# EAGLE board M885E (EAGLE 6.6.0), part 1 of 2
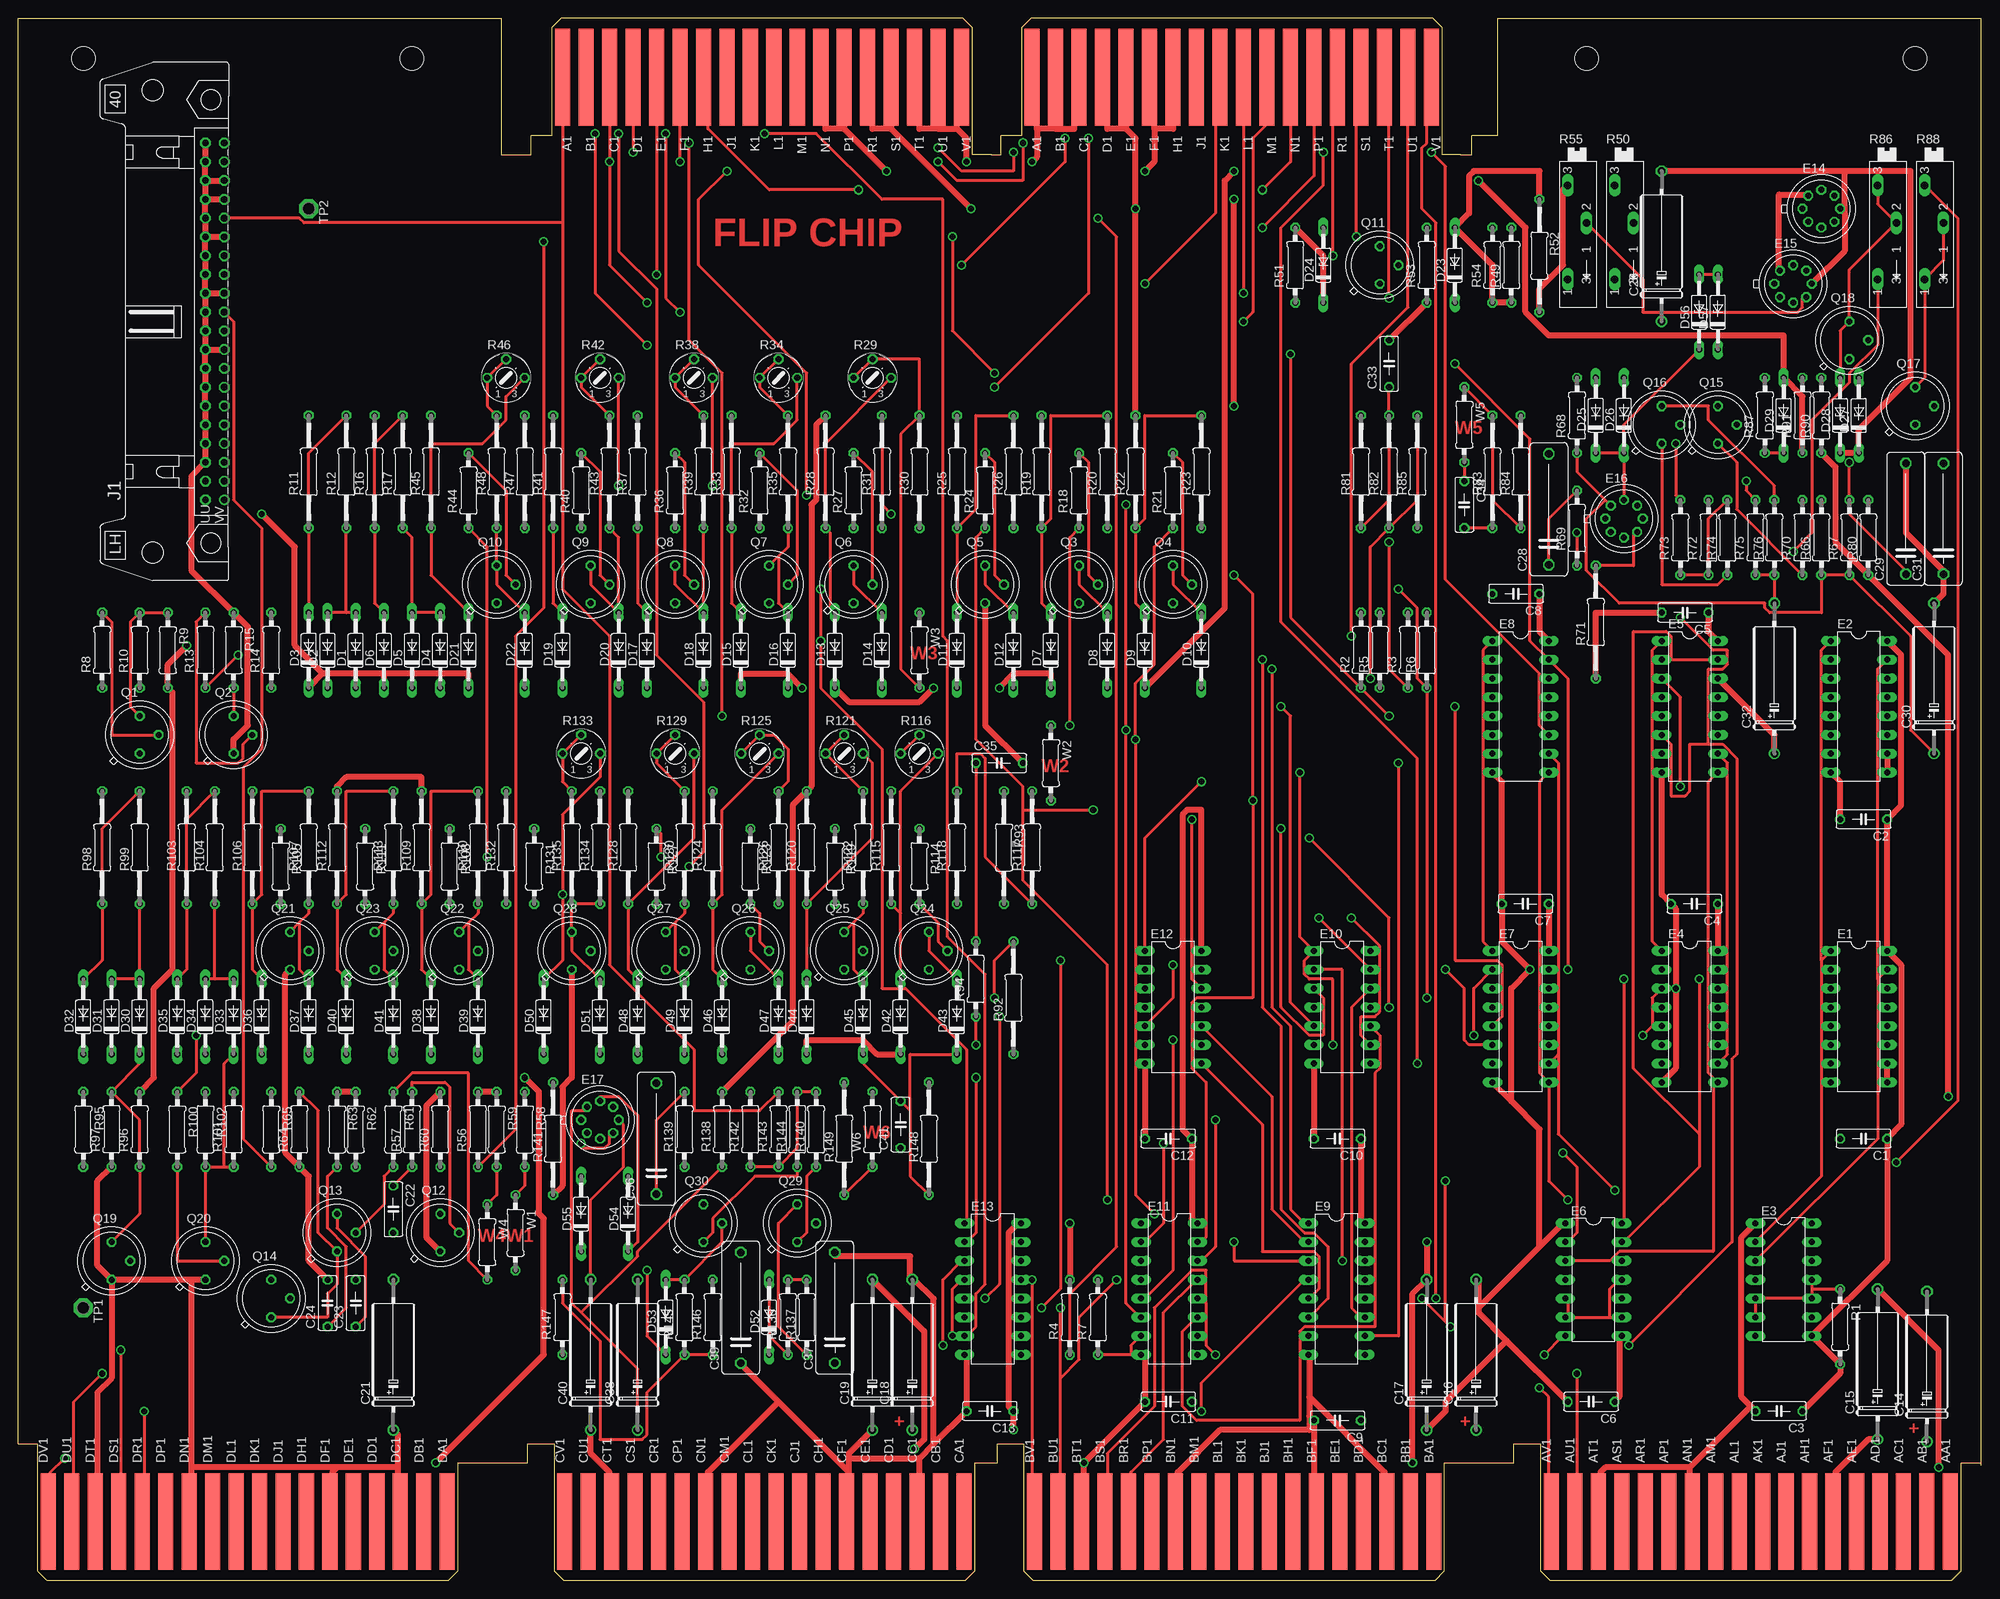
[diagram p2: board, top side]
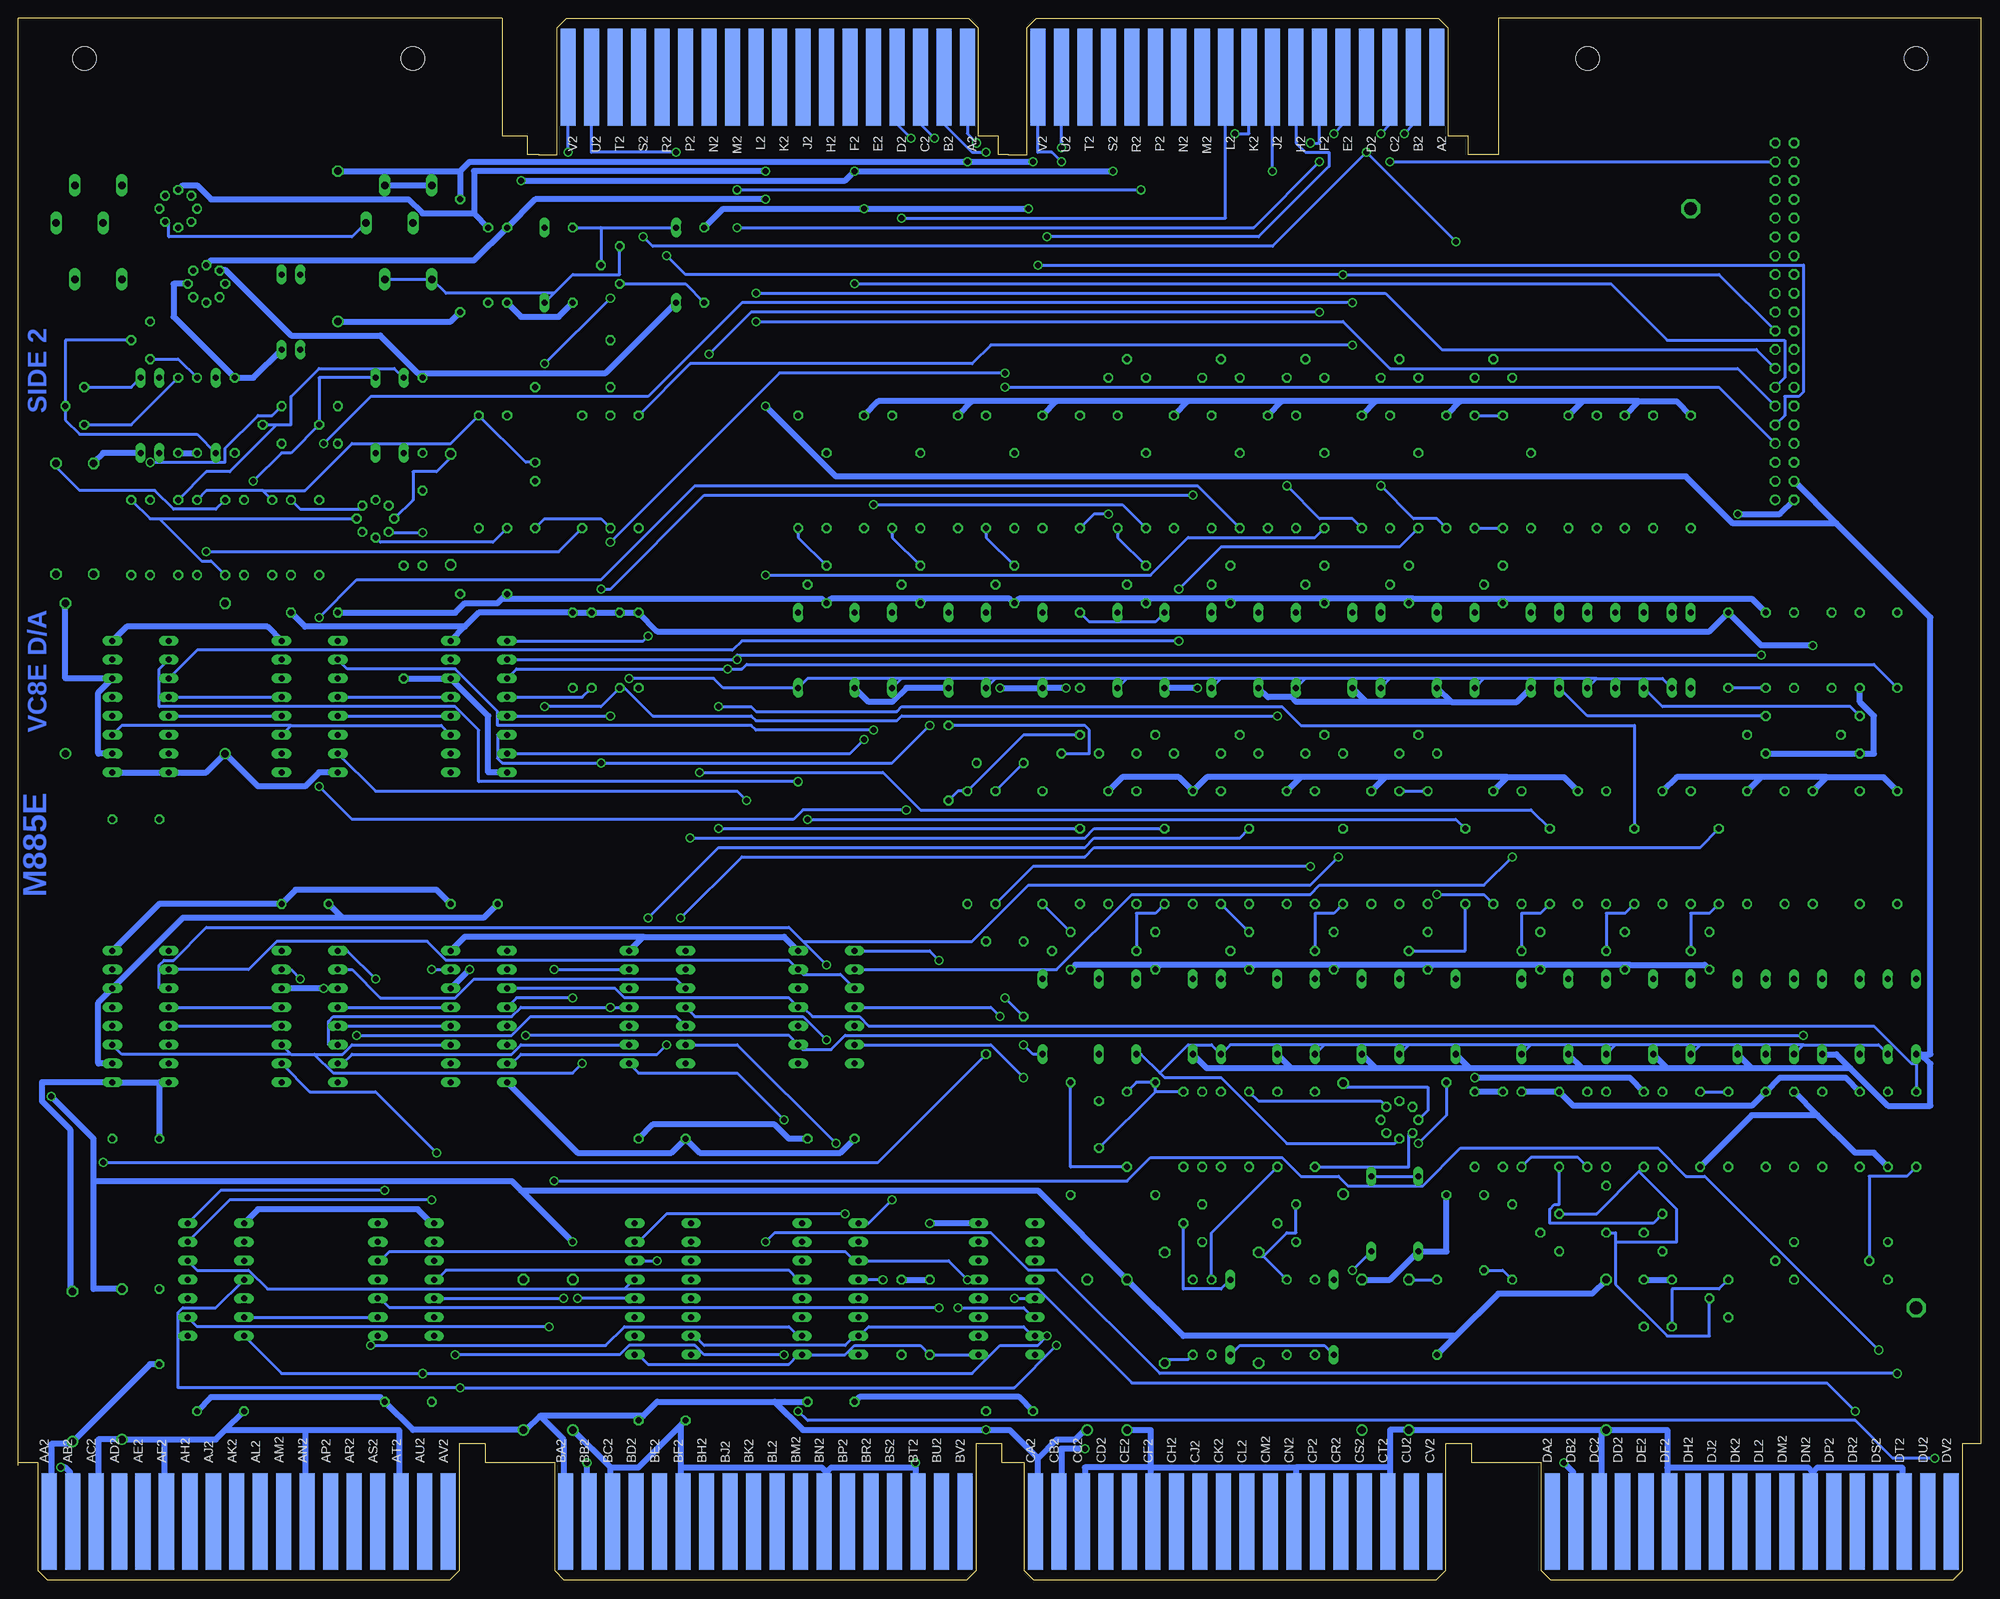
[diagram p3: board, bottom side, seen from below]

Size 265.3 x 211.14 mm. Coordinates in mm from the lower left corner, seen from the top.
Outline: 131.44,192.72 132.8,192.72 132.8,195.26 133.38,195.26
Outline: 265.3,15.56 265.3,211.14 199.9,211.14 199.9,195.26 196.47,195.26 196.47,192.72 194.94,192.72
Outline: 68.6,192.72 65.28,192.72 65.28,211.14 0,211.14 0,18.41
Outline: 69.88,195.26 69.3,195.26 69.3,192.72 68.45,192.72
Copper layers (1+2+15+16): Top 0.035mm / dielectric 1.5mm / ECO1 0.035mm / dielectric 0.15mm / ECO2 0.035mm / dielectric 0.2mm / Bottom 0.035mm
Design rules "16mils *": minimum track width 16mil, minimum drill 32mil, track to track 15mil, track to pad 10mil, pad to pad 10mil, via to via 10mil, smd to smd 10mil, copper to edge 13mil, drill to drill 10mil, minimum pad ring 10mil, minimum via ring 8mil, stop-mask expansion 0mil, vias tented up to drill 0mil, thermal gap 10mil
Net classes: 1 supply: width 0.813 mm
Holes 3.2 mm at 53.21,205.74 8.76,205.74 211.96,205.74 256.41,205.74

## Footprints (pad centres in the part's own frame; a part is rotated, then mirrored left to right if it is on the bottom)
C063-025X075 = drill 0.813 octagon: 1 -2.54,0; 2 3.81,0
E12-8 = drill 1.016: + -10.16,0 | drill 1.016 octagon: - 10.16,0
C150-054X183 = drill 1.016 octagon: 1 -7.493,0; 2 7.493,0
DO35-10 = drill 0.813 long: A 5.08,0; C -5.08,0
DO35Z10 = drill 0.813 long: A 5.08,0; C -5.08,0
DIL16 = drill 0.813 long: 1 -8.89,-3.81; 2 -6.35,-3.81; 3 -3.81,-3.81; 4 -1.27,-3.81; 5 1.27,-3.81; 6 3.81,-3.81; 7 6.35,-3.81; 8 8.89,-3.81; 9 8.89,3.81; 10 6.35,3.81; 11 3.81,3.81; 12 1.27,3.81; 13 -1.27,3.81; 14 -3.81,3.81; 15 -6.35,3.81; 16 -8.89,3.81
DIL14 = drill 0.813 long: 1 -7.62,-3.81; 2 -5.08,-3.81; 3 -2.54,-3.81; 4 0,-3.81; 5 2.54,-3.81; 6 5.08,-3.81; 7 7.62,-3.81; 8 7.62,3.81; 9 5.08,3.81; 10 2.54,3.81; 11 0,3.81; 12 -2.54,3.81; 13 -5.08,3.81; 14 -7.62,3.81
TO99 = drill 0.813 octagon: 1 -1.778,-1.778; 2 0,-2.54; 3 1.778,-1.778; 4 2.54,0; 5 1.778,1.778; 6 0,2.54; 7 -1.778,1.778; 8 -2.54,0
EDGE-CON2 = smd 13.106 x 2.032: A1 7.938,4.128; B1 7.938,7.303; C1 7.938,10.477; D1 7.938,13.652; E1 7.938,16.828; F1 7.938,20.003; H1 7.938,23.177; J1 7.938,26.352; K1 7.938,29.527; L1 7.938,32.703; M1 7.938,35.877; N1 7.938,39.053; P1 7.938,42.227; R1 7.938,45.403; S1 7.938,48.578; T1 7.938,51.752; U1 7.938,54.928; V1 7.938,58.102 | smd 13.106 x 2.032 bottom: A2 7.938,4.128; B2 7.938,7.303; C2 7.938,10.477; D2 7.938,13.652; E2 7.938,16.828; F2 7.938,20.003; H2 7.938,23.177; J2 7.938,26.352; K2 7.938,29.527; L2 7.938,32.703; M2 7.938,35.877; N2 7.938,39.053; P2 7.938,42.227; R2 7.938,45.403; S2 7.938,48.578; T2 7.938,51.752; U2 7.938,54.928; V2 7.938,58.102
DEC40PINH = drill 0.914 octagon: A 24.13,1.27; AA -3.81,1.27; B 24.13,-1.27; BB -3.81,-1.27; C 21.59,1.27; CC -6.35,1.27; D 21.59,-1.27; DD -6.35,-1.27; E 19.05,1.27; EE -8.89,1.27; F 19.05,-1.27; FF -8.89,-1.27; H 16.51,1.27; HH -11.43,1.27; J 16.51,-1.27; JJ -11.43,-1.27; K 13.97,1.27; KK -13.97,1.27; L 13.97,-1.27; LL -13.97,-1.27; M 11.43,1.27; MM -16.51,1.27; N 11.43,-1.27; NN -16.51,-1.27; P 8.89,1.27; PP -19.05,1.27; R 8.89,-1.27; RR -19.05,-1.27; S 6.35,1.27; SS -21.59,1.27; T 6.35,-1.27; TT -21.59,-1.27; U 3.81,1.27; UU -24.13,1.27; V 3.81,-1.27; W 1.27,1.27; X 1.27,-1.27; Y -1.27,1.27; Z -1.27,-1.27 | drill 0.914: VV -24.13,-1.27
EDGE-CON8 = smd 2.032 x 13.106: AA1 261.303,7.938; AB1 258.127,7.938; AC1 254.952,7.938; AD1 251.778,7.938; AE1 248.602,7.938; AF1 245.428,7.938; AH1 242.252,7.938; AJ1 239.077,7.938; AK1 235.903,7.938; AL1 232.727,7.938; AM1 229.553,7.938; AN1 226.377,7.938; AP1 223.202,7.938; AR1 220.028,7.938; AS1 216.852,7.938; AT1 213.678,7.938; AU1 210.502,7.938; AV1 207.327,7.938; BA1 191.452,7.938; BB1 188.278,7.938; BC1 185.102,7.938; BD1 181.928,7.938; BE1 178.752,7.938; BF1 175.577,7.938; BH1 172.403,7.938; BJ1 169.227,7.938; BK1 166.053,7.938; BL1 162.877,7.938; BM1 159.702,7.938; BN1 156.528,7.938; BP1 153.352,7.938; BR1 150.178,7.938; BS1 147.002,7.938; BT1 143.827,7.938; BU1 140.653,7.938; BV1 137.477,7.938; CA1 127.953,7.938; CB1 124.778,7.938; CC1 121.603,7.938; CD1 118.427,7.938; CE1 115.252,7.938; CF1 112.078,7.938; CH1 108.903,7.938; CJ1 105.728,7.938; CK1 102.552,7.938; CL1 99.377,7.938; CM1 96.203,7.938; CN1 93.028,7.938; CP1 89.853,7.938; CR1 86.677,7.938; CS1 83.502,7.938; CT1 80.328,7.938; CU1 77.153,7.938; CV1 73.978,7.938; DA1 58.102,7.938; DB1 54.928,7.938; DC1 51.752,7.938; DD1 48.578,7.938; DE1 45.403,7.938; DF1 42.227,7.938; DH1 39.053,7.938; DJ1 35.877,7.938; DK1 32.703,7.938; DL1 29.527,7.938; DM1 26.352,7.938; DN1 23.177,7.938; DP1 20.003,7.938; DR1 16.828,7.938; DS1 13.652,7.938; DT1 10.477,7.938; DU1 7.303,7.938; DV1 4.128,7.938 | smd 2.032 x 13.106 bottom: AA2 261.303,7.938; AB2 258.127,7.938; AC2 254.952,7.938; AD2 251.778,7.938; AE2 248.602,7.938; AF2 245.428,7.938; AH2 242.252,7.938; AJ2 239.077,7.938; AK2 235.903,7.938; AL2 232.727,7.938; AM2 229.553,7.938; AN2 226.377,7.938; AP2 223.202,7.938; AR2 220.028,7.938; AS2 216.852,7.938; AT2 213.678,7.938; AU2 210.502,7.938; AV2 207.327,7.938; BA2 191.452,7.938; BB2 188.278,7.938; BC2 185.102,7.938; BD2 181.928,7.938; BE2 178.752,7.938; BF2 175.577,7.938; BH2 172.403,7.938; BJ2 169.227,7.938; BK2 166.053,7.938; BL2 162.877,7.938; BM2 159.702,7.938; BN2 156.528,7.938; BP2 153.352,7.938; BR2 150.178,7.938; BS2 147.002,7.938; BT2 143.827,7.938; BU2 140.653,7.938; BV2 137.477,7.938; CA2 127.953,7.938; CB2 124.778,7.938; CC2 121.603,7.938; CD2 118.427,7.938; CE2 115.252,7.938; CF2 112.078,7.938; CH2 108.903,7.938; CJ2 105.728,7.938; CK2 102.552,7.938; CL2 99.377,7.938; CM2 96.203,7.938; CN2 93.028,7.938; CP2 89.853,7.938; CR2 86.677,7.938; CS2 83.502,7.938; CT2 80.328,7.938; CU2 77.153,7.938; CV2 73.978,7.938; DA2 58.102,7.938; DB2 54.928,7.938; DC2 51.752,7.938; DD2 48.578,7.938; DE2 45.403,7.938; DF2 42.227,7.938; DH2 39.053,7.938; DJ2 35.877,7.938; DK2 32.703,7.938; DL2 29.527,7.938; DM2 26.352,7.938; DN2 23.177,7.938; DP2 20.003,7.938; DR2 16.828,7.938; DS2 13.652,7.938; DT2 10.477,7.938; DU2 7.303,7.938; DV2 4.128,7.938
TO5 = drill 0.813 octagon: 1 0,-2.54; 2 2.54,0; 3 0,2.54
0207/10 = drill 0.813 octagon: 1 -5.08,0; 2 5.08,0
0207/15 = drill 0.813 octagon: 1 -7.62,0; 2 7.62,0
S75P = drill 0.813 octagon: A -2.54,0; E 2.54,0; S 0,2.54
SP19L = drill 1.016 long: A 5.715,-1.27; E -6.985,-1.27; S -1.905,1.27
P1-17 = drill 1.702 pad 2.54 octagon: TP 0,0

## Placement (x,y rotation side)
C1  .01uF  [C063-025X075]  250.06,59.69 180 top
C2  .01uF  [C063-025X075]  250.06,102.87 180 top
C3  .01uF  [C063-025X075]  238.63,22.86 180 top
C4  .01uF  [C063-025X075]  227.2,91.44 180 top
C5  .01uF  [C063-025X075]  225.93,130.81 180 top
C6  .01uF  [C063-025X075]  213.23,24.13 180 top
C7  .01uF  [C063-025X075]  204.34,91.44 180 top
C8  .01uF  [C063-025X075]  203.07,133.35 180 top
C9  .01uF  [C063-025X075]  178.94,21.59 180 top
C10  .01uF  [C063-025X075]  178.94,59.69 180 top
C11  .01uF  [C063-025X075]  156.08,24.13 180 top
C12  .01uF  [C063-025X075]  156.08,59.69 180 top
C13  .01uF  [C063-025X075]  131.95,22.86 180 top
C14  6.8uF  [E12-8]  258,28.89 90 top
C15  6.8uF  [E12-8]  251.33,29.21 90 top
C16  6.8uF  [E12-8]  197.04,30.48 90 top
C17  6.8uF  [E12-8]  190.37,30.48 90 top
C18  6.8uF  [E12-8]  120.84,30.48 90 top
C19  6.8uF  [E12-8]  115.44,30.48 90 top
C21  6.8uF  [E12-8]  50.67,30.48 90 top
C22  10pF  [C063-025X075]  50.67,50.8 270 top
C23  .01uF  [C063-025X075]  45.59,36.83 90 top
C24  .01uF  [C063-025X075]  41.78,36.83 90 top
C26  6.8uF  [E12-8]  222.12,180.34 90 top
C28  3300pF  [C150-054X183]  206.88,144.78 90 top
C29  .15uF  [C150-054X183]  255.14,143.51 90 top
C30  6.8uF  [E12-8]  258.95,121.92 90 top
C31  .15uF  [C150-054X183]  260.22,143.51 90 top
C32  6.8uF  [E12-8]  237.36,121.92 90 top
C33  100pF  [C063-025X075]  185.29,163.83 90 top
C34  47pF  [C063-025X075]  195.45,146.05 270 top
C35  100pF  [C063-025X075]  131.95,110.49 0 top
C36  3300pF  [C150-054X183]  86.23,59.69 90 top
C37  .15uF  [C150-054X183]  110.36,36.83 90 top
C38  6.8uF  [E12-8]  83.69,30.48 90 top
C39  .15uF  [C150-054X183]  97.66,36.83 90 top
C40  6.8uF  [E12-8]  77.34,30.48 90 top
C41  47pF  [C063-025X075]  119.25,60.96 90 top
D1  1N5711  [DO35-10]  45.59,125.73 90 top
D2  FD777  [DO35-10]  41.78,125.73 90 top
D3  FD777  [DO35-10]  39.24,125.73 90 top
D4  1N5711  [DO35-10]  57.02,125.73 90 top
D5  FD777  [DO35-10]  53.21,125.73 90 top
D6  FD777  [DO35-10]  49.4,125.73 90 top
D7  1N5711  [DO35-10]  139.57,125.73 90 top
D8  1N5711  [DO35-10]  147.19,125.73 90 top
D9  D664  [DO35-10]  152.27,125.73 90 top
D10  D664  [DO35-10]  159.89,125.73 90 top
D11  D664  [DO35-10]  126.87,125.73 90 top
D12  D664  [DO35-10]  134.49,125.73 90 top
D13  D664  [DO35-10]  110.36,125.73 90 top
D14  D664  [DO35-10]  116.71,125.73 90 top
D15  D664  [DO35-10]  97.66,125.73 90 top
D16  D664  [DO35-10]  104.01,125.73 90 top
D17  D664  [DO35-10]  84.96,125.73 90 top
D18  D664  [DO35-10]  92.58,125.73 90 top
D19  D664  [DO35-10]  73.53,125.73 90 top
D20  D664  [DO35-10]  81.15,125.73 90 top
D21  D664  [DO35-10]  60.83,125.73 90 top
D22  D664  [DO35-10]  68.45,125.73 90 top
D23  1N825  [DO35Z10]  194.18,177.8 90 top
D24  1N752A  [DO35Z10]  176.4,177.8 90 top
D25  D664  [DO35-10]  213.23,157.48 90 top
D26  D664  [DO35-10]  217.04,157.48 90 top
D27  1N825  [DO35Z10]  248.79,157.48 90 top
D28  1N825  [DO35Z10]  246.25,157.48 90 top
D29  1N752A  [DO35Z10]  238.63,157.48 90 top
D30  1N5711  [DO35-10]  16.38,76.2 90 top
D31  FD777  [DO35-10]  12.57,76.2 90 top
D32  FD777  [DO35-10]  8.76,76.2 90 top
D33  1N5711  [DO35-10]  29.08,76.2 90 top
D34  FD777  [DO35-10]  25.27,76.2 90 top
D35  FD777  [DO35-10]  21.46,76.2 90 top
D36  1N5711  [DO35-10]  32.89,76.2 90 top
D37  1N5711  [DO35-10]  39.24,76.2 90 top
D38  D664  [DO35-10]  55.75,76.2 90 top
D39  D664  [DO35-10]  62.1,76.2 90 top
D40  D664  [DO35-10]  44.32,76.2 90 top
D41  D664  [DO35-10]  50.67,76.2 90 top
D42  D664  [DO35-10]  119.25,76.2 90 top
D43  D664  [DO35-10]  126.87,76.2 90 top
D44  D664  [DO35-10]  106.55,76.2 90 top
D45  D664  [DO35-10]  114.17,76.2 90 top
D46  D664  [DO35-10]  95.12,76.2 90 top
D47  D664  [DO35-10]  102.74,76.2 90 top
D48  D664  [DO35-10]  83.69,76.2 90 top
D49  D664  [DO35-10]  90.04,76.2 90 top
D50  D664  [DO35-10]  70.99,76.2 90 top
D51  D664  [DO35-10]  78.61,76.2 90 top
D52  D664  [DO35-10]  101.47,35.56 90 top
D53  D664  [DO35-10]  87.5,35.56 90 top
D54  1N752A  [DO35Z10]  82.42,49.53 90 top
D55  1N752A  [DO35Z10]  76.07,49.53 90 top
D56  1N752A  [DO35Z10]  227.2,171.45 90 top
D57  1N752A  [DO35Z10]  229.74,171.45 90 top
E1  74193N  [DIL16]  248.79,76.2 270 top
E2  74193N  [DIL16]  248.79,118.11 270 top
E3  SP380N  [DIL14]  238.63,40.64 270 top
E4  74193N  [DIL16]  225.93,76.2 270 top
E5  74193N  [DIL16]  225.93,118.11 270 top
E6  SP380N  [DIL14]  212.92,40.64 270 top
E7  74193N  [DIL16]  203.07,76.2 270 top
E8  74193N  [DIL16]  203.07,118.11 270 top
E9  DEC8235  [DIL16]  178.18,39.37 270 top
E10  7404N  [DIL14]  178.94,77.47 270 top
E11  DEC8235  [DIL16]  155.57,39.37 270 top
E12  7404N  [DIL14]  156.08,77.47 270 top
E13  DEC8235  [DIL16]  131.7,39.37 270 top
E14  LM302  [TO99]  243.71,185.42 0 top
E15  LM302  [TO99]  239.9,175.26 0 top
E16  MC1439  [TO99]  217.04,143.51 0 top
E17  MC1439  [TO99]  78.61,62.23 0 top
F  EDGE-TOP  [EDGE-CON2]  132.91,211.14 270 top
H  EDGE-TOP  [EDGE-CON2]  69.41,211.14 270 top
J1  [DEC40PINH]  26.54,170.18 90 top
OMNIBUS  QUAD  [EDGE-CON8]  -0.13,0 0 top
Q1  2N3009  [TO5]  16.38,114.3 0 top
Q2  2N3009  [TO5]  29.08,114.3 0 top
Q3  2N3009  [TO5]  143.38,134.62 0 top
Q4  2N3009  [TO5]  156.08,134.62 0 top
Q5  2N3009  [TO5]  130.68,134.62 0 top
Q6  2N3009  [TO5]  112.9,134.62 0 top
Q7  2N3009  [TO5]  101.47,134.62 0 top
Q8  2N3009  [TO5]  88.77,134.62 0 top
Q9  2N3009  [TO5]  77.34,134.62 0 top
Q10  2N3009  [TO5]  64.64,134.62 0 top
Q11  MPS6534  [TO5]  184.02,177.8 0 top
Q12  2N4313  [TO5]  57.02,46.99 0 top
Q13  2N3009  [TO5]  43.05,46.99 0 top
Q14  MPS6534  [TO5]  34.16,38.1 0 top
Q15  2N2219  [TO5]  229.74,156.21 0 top
Q16  MPS6534  [TO5]  222.12,156.21 0 top
Q17  2N2219  [TO5]  256.41,158.75 0 top
Q18  2N2219  [TO5]  247.52,167.64 0 top
Q19  2N3009  [TO5]  12.57,43.18 0 top
Q20  2N3009  [TO5]  25.27,43.18 0 top
Q21  2N3009  [TO5]  36.7,85.09 0 top
Q22  2N3009  [TO5]  59.56,85.09 0 top
Q23  2N3009  [TO5]  48.13,85.09 0 top
Q24  2N3009  [TO5]  123.06,85.09 0 top
Q25  2N3009  [TO5]  111.63,85.09 0 top
Q26  2N3009  [TO5]  98.93,85.09 0 top
Q27  2N3009  [TO5]  87.5,85.09 0 top
Q28  2N3009  [TO5]  74.8,85.09 0 top
Q29  2N2219  [TO5]  105.28,48.26 0 top
Q30  MPS6534  [TO5]  92.58,48.26 0 top
R1  1K  [0207/10]  246.25,34.29 270 top
R2  1K  [0207/10]  181.48,125.73 90 top
R3  1K  [0207/10]  187.83,125.73 90 top
R4  1K  [0207/10]  142.11,35.56 90 top
R5  1K  [0207/10]  184.02,125.73 90 top
R6  1K  [0207/10]  190.37,125.73 90 top
R7  1K  [0207/10]  145.92,35.56 90 top
R8  3.3K  [0207/10]  11.3,125.73 90 top
R9  3.3K  [0207/10]  20.19,125.73 270 top
R10  2.2K  [0207/10]  16.38,125.73 90 top
R11  511K  [0207/15]  39.24,149.86 90 top
R12  511K  [0207/15]  44.32,149.86 90 top
R13  3.3K  [0207/10]  25.27,125.73 90 top
R14  3.3K  [0207/10]  34.16,125.73 90 top
R15  2.2K  [0207/10]  29.08,125.73 270 top
R16  243K  [0207/15]  48.13,149.86 90 top
R17  256K  [0207/15]  51.94,149.86 90 top
R18  3.3K  [0207/10]  143.38,147.32 90 top
R19  121K  [0207/15]  138.3,149.86 90 top
R20  128K  [0207/15]  147.19,149.86 90 top
R21  3.3K  [0207/10]  156.08,147.32 90 top
R22  68.1K  [0207/15]  151,149.86 90 top
R23  64K  [0207/15]  159.89,149.86 90 top
R24  3.3K  [0207/10]  130.68,147.32 90 top
R25  31.6K  [0207/15]  126.87,149.86 90 top
R26  32K  [0207/15]  134.49,149.86 90 top
R27  3.3K  [0207/10]  112.9,147.32 90 top
R28  14.7K  [0207/15]  109.09,149.86 90 top
R29  500  [S75P]  115.44,162.56 0 top
R30  7.985K  [0207/15]  121.79,149.86 90 top
R31  7.985K  [0207/15]  116.71,149.86 90 top
R32  3.3K  [0207/10]  100.2,147.32 90 top
R33  8.25K  [0207/15]  96.39,149.86 90 top
R34  100  [S75P]  102.74,162.56 0 top
R35  7.985K  [0207/15]  104.01,149.86 90 top
R36  3.3K  [0207/10]  88.77,147.32 90 top
R37  3.83K  [0207/15]  83.69,149.86 90 top
R38  50  [S75P]  91.31,162.56 0 top
R39  3.987K  [0207/15]  92.58,149.86 90 top
R40  3.3K  [0207/10]  76.07,147.32 90 top
R41  1.96K  [0207/15]  72.26,149.86 90 top
R42  50  [S75P]  78.61,162.56 0 top
R43  1.992K  [0207/15]  79.88,149.86 90 top
R44  3.3K  [0207/10]  60.83,147.32 90 top
R45  1K  [0207/15]  55.75,149.86 90 top
R46  20  [S75P]  65.91,162.56 0 top
R47  200K  [0207/15]  68.45,149.86 90 top
R48  1K  [0207/15]  64.64,149.86 90 top
R49  390  [0207/10]  201.8,177.8 90 top
R50  2K  [SP19L]  217.04,181.61 270 top
R51  390  [0207/10]  172.59,177.8 90 top
R52  3.16K  [0207/15]  205.61,179.07 270 top
R53  3.9K  [0207/10]  190.37,177.8 90 top
R54  390  [0207/10]  199.26,177.8 90 top
R55  2K  [SP19L]  210.69,181.61 270 top
R56  470  [0207/10]  62.1,60.96 90 top
R57  2.2K  [0207/10]  53.21,60.96 90 top
R58  1.2K  [0207/10]  68.45,60.96 270 top
R59  6.8K  [0207/10]  64.64,60.96 270 top
R60  100  [0207/10]  57.02,60.96 90 top
R61  390  [0207/10]  50.67,60.96 270 top
R62  2.2K  [0207/10]  45.59,60.96 270 top
R63  390  [0207/10]  43.05,60.96 270 top
R64  2.2K  [0207/10]  37.97,60.96 90 top
R65  47  [0207/10]  34.16,60.96 270 top
R66  4.7K  [0207/10]  243.71,140.97 90 top
R67  390  [0207/10]  247.52,140.97 90 top
R68  18  [0207/10]  210.69,157.48 90 top
R69  390  [0207/10]  210.69,142.24 90 top
R70  18  [0207/10]  241.17,140.97 90 top
R71  1K 1%  [0207/15]  213.23,129.54 90 top
R72  10K  [0207/10]  228.47,140.97 90 top
R73  47  [0207/10]  224.66,140.97 90 top
R74  18  [0207/10]  231.01,140.97 90 top
R75  4.7K  [0207/10]  234.82,140.97 90 top
R76  390  [0207/10]  237.36,140.97 90 top
R80  18  [0207/10]  250.06,140.97 90 top
R81  1.96K 1%  [0207/15]  181.48,149.86 90 top
R82  8.25K  [0207/15]  185.29,149.86 90 top
R83  133  [0207/15]  199.26,149.86 90 top
R84  866 1%  [0207/15]  203.07,149.86 90 top
R85  1K 1%  [0207/15]  189.1,149.86 90 top
R86  500  [SP19L]  252.6,181.61 270 top
R87  3.9K  [0207/10]  236.09,157.48 90 top
R88  500  [SP19L]  258.95,181.61 270 top
R90  390  [0207/10]  243.71,157.48 90 top
R91  390  [0207/10]  241.17,157.48 90 top
R92  1K 1%  [0207/15]  134.49,78.74 90 top
R93  1.96K 1%  [0207/15]  133.22,99.06 270 top
R94  8.25K 1%  [0207/10]  129.41,81.28 90 top
R95  3.3K  [0207/10]  8.76,60.96 270 top
R96  3.3K  [0207/10]  16.38,60.96 90 top
R97  2.2K  [0207/10]  12.57,60.96 90 top
R98  511K  [0207/15]  11.3,99.06 90 top
R99  511K  [0207/15]  16.38,99.06 90 top
R100  3.3K  [0207/10]  21.46,60.96 270 top
R101  3.3K  [0207/10]  29.08,60.96 90 top
R102  2.2K  [0207/10]  25.27,60.96 270 top
R103  243K  [0207/15]  22.73,99.06 90 top
R104  256K  [0207/15]  26.54,99.06 90 top
R105  3.3K  [0207/10]  35.43,96.52 270 top
R106  121K  [0207/15]  31.62,99.06 90 top
R107  128K  [0207/15]  39.24,99.06 90 top
R108  3.3K  [0207/10]  58.29,96.52 270 top
R109  68.1K  [0207/15]  54.48,99.06 90 top
R110  64K  [0207/15]  62.1,99.06 90 top
R111  3.3K  [0207/10]  46.86,96.52 270 top
R112  31.6K  [0207/15]  43.05,99.06 90 top
R113  32K  [0207/15]  50.67,99.06 90 top
R114  3.3K  [0207/10]  121.79,96.52 270 top
R115  14.7K  [0207/15]  117.98,99.06 90 top
R116  500  [S75P]  121.79,111.76 0 top
R117  7.985K  [0207/15]  137.03,99.06 90 top
R118  7.985K  [0207/15]  126.87,99.06 90 top
R119  3.3K  [0207/10]  110.36,96.52 270 top
R120  8.25K  [0207/15]  106.55,99.06 90 top
R121  100  [S75P]  111.63,111.76 0 top
R122  7.985K  [0207/15]  114.17,99.06 90 top
R123  3.3K  [0207/10]  98.93,96.52 270 top
R124  3.83K  [0207/15]  93.85,99.06 90 top
R125  50  [S75P]  100.2,111.76 0 top
R126  3.987K  [0207/15]  102.74,99.06 90 top
R127  3.3K  [0207/10]  86.23,96.52 270 top
R128  1.96K  [0207/15]  82.42,99.06 90 top
R129  50  [S75P]  88.77,111.76 0 top
R130  1.992K  [0207/15]  90.04,99.06 90 top
R131  3.3K  [0207/10]  69.72,96.52 270 top
R132  1K  [0207/15]  65.91,99.06 90 top
R133  20  [S75P]  76.07,111.76 0 top
R134  200K  [0207/15]  78.61,99.06 90 top
R135  1K  [0207/15]  74.8,99.06 90 top
R136  4.7K  [0207/10]  104.01,35.56 90 top
R137  390  [0207/10]  106.55,35.56 90 top
R138  18  [0207/10]  95.12,60.96 90 top
R139  390  [0207/10]  90.04,60.96 90 top
R140  18  [0207/10]  107.82,60.96 90 top
R141  1K 1%  [0207/15]  72.26,59.69 90 top
R142  10K  [0207/10]  98.93,60.96 90 top
R143  47  [0207/10]  102.74,60.96 90 top
R144  18  [0207/10]  105.28,60.96 90 top
R145  4.7K  [0207/10]  90.04,35.56 90 top
R146  390  [0207/10]  93.85,35.56 90 top
R147  18  [0207/10]  73.53,35.56 90 top
R148  133  [0207/15]  123.06,59.69 90 top
R149  866 1%  [0207/15]  111.63,59.69 90 top
TP1  TPSQPAD1-17  [P1-17]  8.76,36.83 270 top
TP2  TPSQPAD1-17  [P1-17]  39.24,185.42 270 top
W1  0  [0207/10]  67.18,46.99 270 top
W2  open  [0207/10]  139.57,110.49 270 top
W3  open  [0207/10]  121.79,125.73 270 top
W4  OPEN  [0207/10]  63.37,45.72 270 top
W5  OPEN  [0207/10]  195.45,156.21 270 top
W6  OPEN  [0207/10]  115.44,60.96 90 top